# EasyEDA schematic SCH_Final_Drone_2024-05-21.json
TITLE: ATMEGA Based Quadcopter Circuit Design; REV: 1.0; Date: 2020-01-29; Sheet: 1/1; Drawn By: itcef; Company: Tamazgha
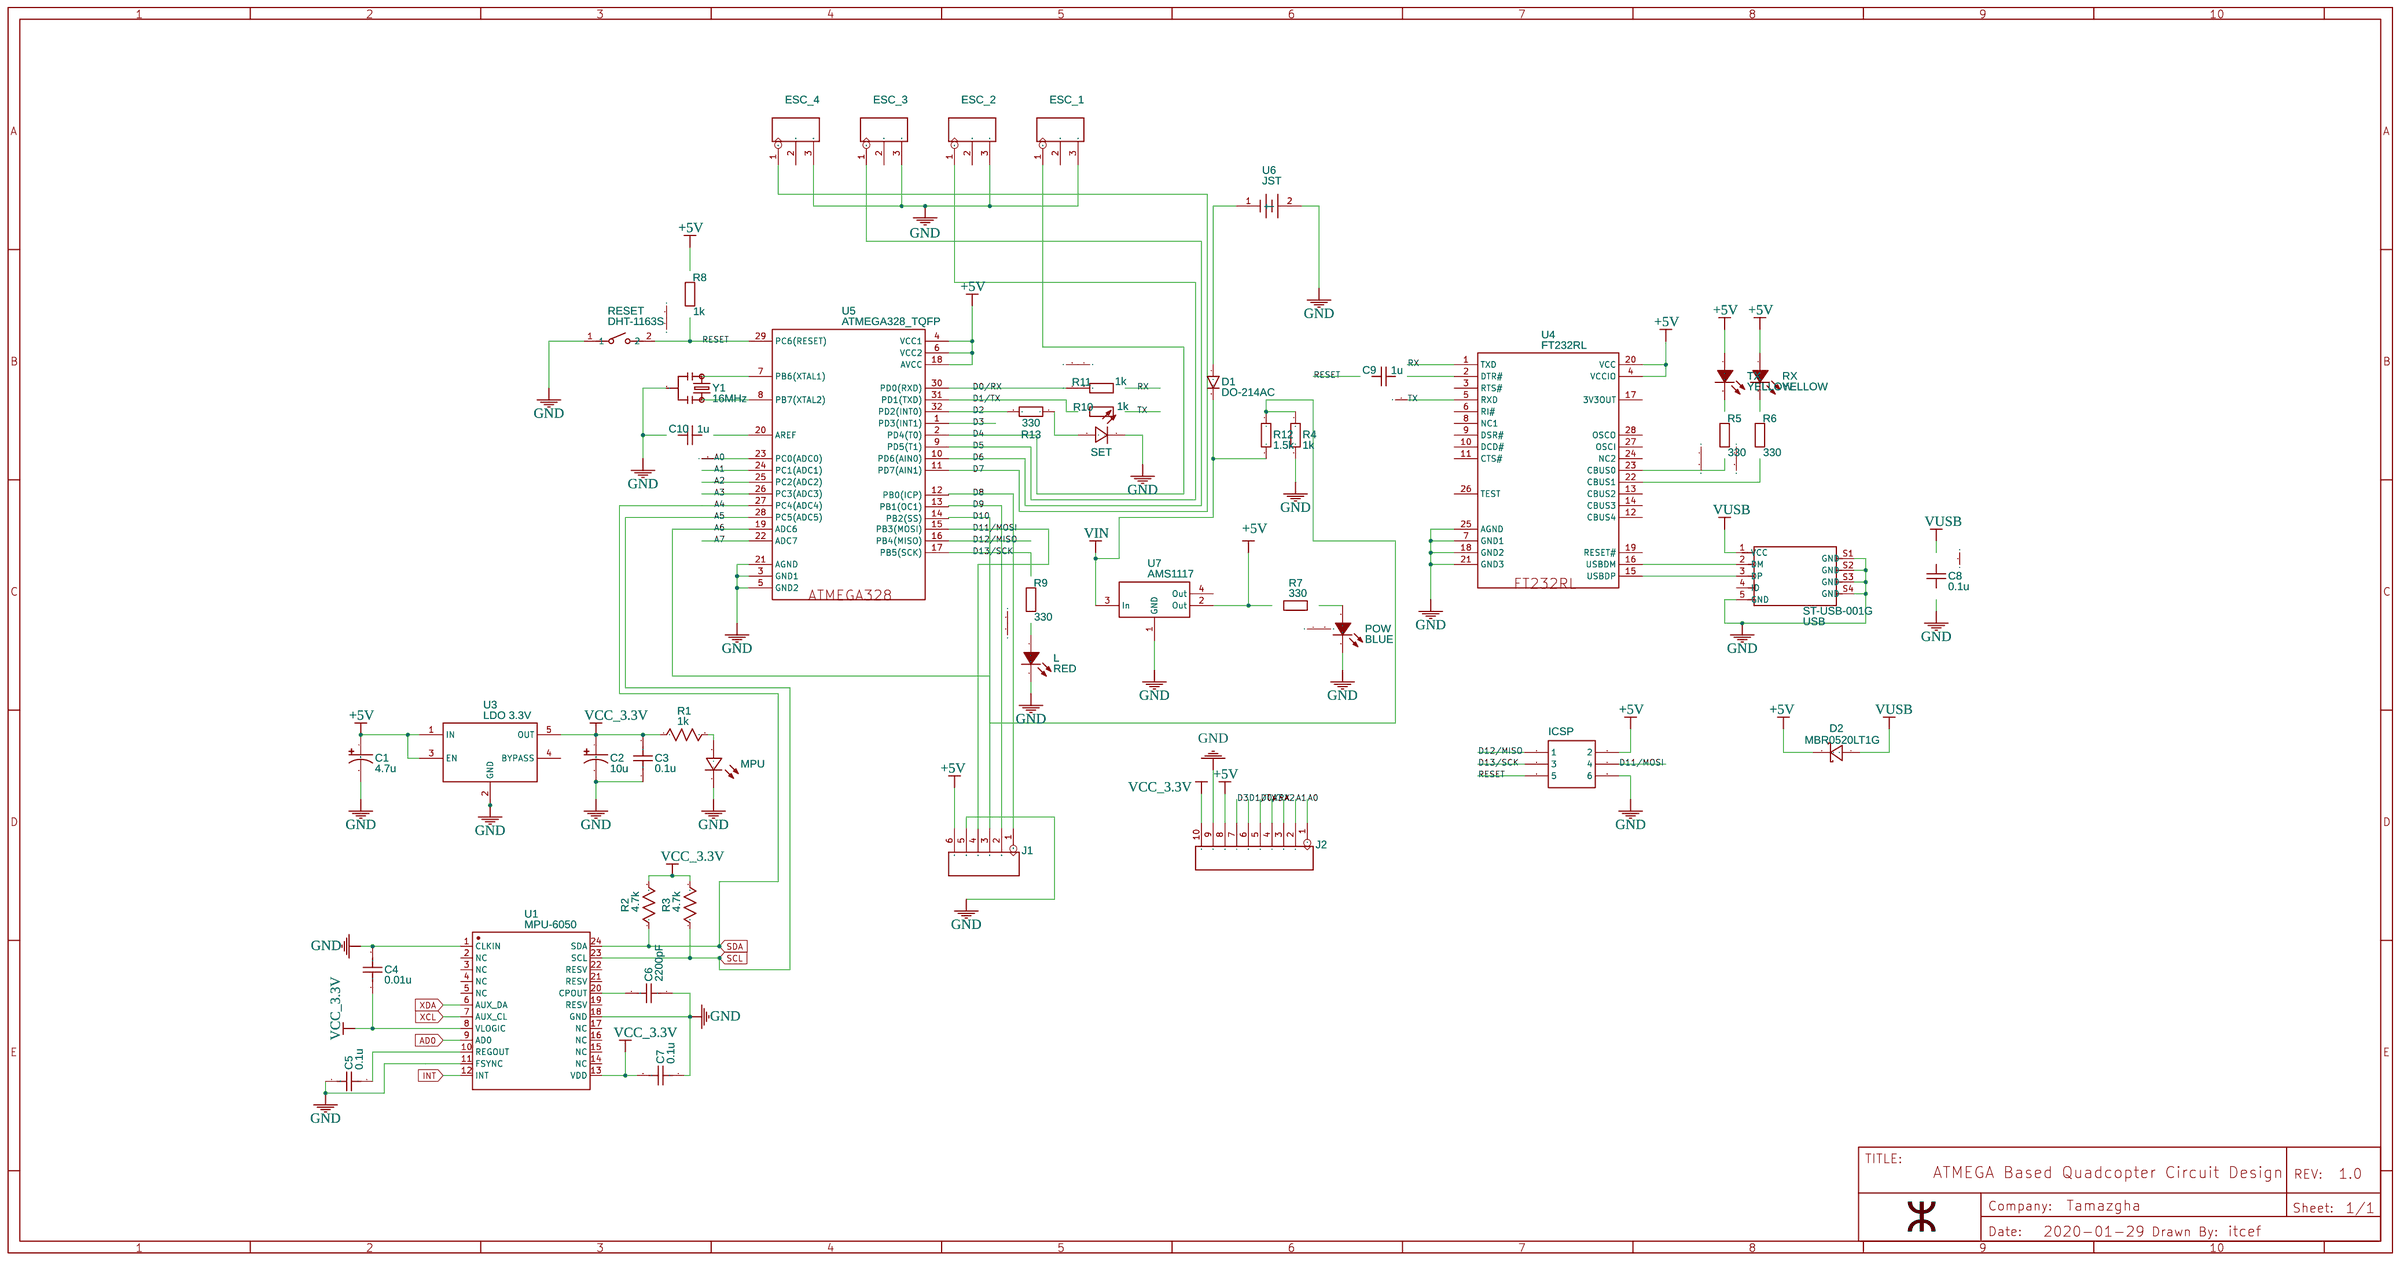
[diagram p0: schematic sheet]

## Parts
C1  4.7u  [C3216]
C2  10u  [C3216]
C3  0.1u  [C0603]
C4  0.01u  [C0603]
C5  0.1u  [C0603]
C6  2200pF  [C0603]
C7  0.1u  [C0603]
C8  0.1u  [C0603]
C9  1u  [C0603]
C10  1u  [C0603]
D1  DO-214AC  [SMA(DO-214AC)]
D2  MBR0520LT1G  [MBR0520LT1G]
ESC_1  DIP-Black-Male-Header-VERT-3P  [H3-2.54]
ESC_2  DIP-Black-Male-Header-VERT-3P  [H3-2.54]
ESC_3  DIP-Black-Male-Header-VERT-3P  [H3-2.54]
ESC_4  DIP-Black-Male-Header-VERT-3P  [H3-2.54]
ICSP  HDR2X3  [HDR2X3]
J1  DIP Long Blue Female Header  [H6-2.54]
J2  DIP-YELLOW-FEMALE-HEADER-VERT(10P-2.54)  [H10-2.54]
L  RED  [D0603-RD]
MPU  LED  [D0603-RD]
POW  BLUE  [D0603-RD]
R1  1k  [R0603]
R2  4.7k  [R0603]
R3  4.7k  [R0603]
R4  1k  [R0603]
R5  330  [R0603]
R6  330  [R0603]
R7  330  [R0603]
R8  1k  [R0603]
R9  330  [R0603]
R10  1k  [R0603]
R11  1k  [R0603]
R12  1.5k  [R0603]
R13  330  [R0603]
RESET  DHT-1163S  [SW2-4.0-6.0X3.0X2.5MM]
RX  YELLOW  [D0603-RD]
SET  LED  [LED-3MM/2.54]
TX  YELLOW  [D0603-RD]
U1  MPU-6050  [QFN-24_4X4X05P]
U3  LDO 3.3V  [SOT-23-5]
U4  FT232RL  [SSOP-28]
U5  ATMEGA328_TQFP  [TQFP32]
U6  JST  [2PIN_2.54_MM_JST_XHP_JST_CONNECTOR]
U7  AMS1117  [SOT-223]
USB  ST-USB-001G  [MICRO-USB5+4P-SMD-0.65-B]
Y1  16MHz  [QUARTZ_SMD_16MHZ]

## Library data of the parts
C1 C2 = Capacitor: Manufacturer Part: ?; Mounted: Yes
C3-C6 = Cap_RAD-0.1_US: Manufacturer Part: ?; Mounted: Yes
C7 = Cap_RAD-0.1_US: Manufacturer Part: ?
C8-C10 = Capacitor: Manufacturer Part: ?
D1 = RS1BB-13-F
D2 = MBR0520LT1G: Contributor: pb158
ESC_1-ESC_4 = DIP-Black-Male-Header-VERT-3P: Manufacturer Part: ?
ICSP = -: catid: 20; Manufacturer Part: ?
J1 = DIP Long Blue Female Header: Manufacturer Part: ?
J2 = DIP-YELLOW-FEMALE-HEADER-VERT(10P-2.54): 320030059
L POW RX TX = LED: Manufacturer Part: ?
MPU SET = -: Supplier: LCSC; Manufacturer: EVERLIGHT; Manufacturer Part: 204-10UYC/S530-A3; Mounted: Yes
R1 = Res_AXIAL-0.3(1/8W)_US: Manufacturer Part: ?
R2 R3 = Res_AXIAL-0.3(1/8W)_US: Manufacturer Part: ?; Mounted: Yes
R4-R13 = Resistor: Manufacturer Part: ?
RESET = -: SMD Button Top;12V; catid: 20; Supplier: SeeedStudio; sourceId: xl1xPJpjB; Supplier Part: 311020029
U1 = -: sourceId: 1T5FDZYC8; Supplier: LCSC; Manufacturer: InvenSense; LCSC Assembly: Yes; image: //image.lceda.cn/szlcsc/C24112.jpg; Supplier Part: C24112
U3 = -: Supplier: LCSC; Manufacturer: TI; Manufacturer Part: TPS79133DBVR; image: //image.lceda.cn/szlcsc/C9838.jpg; Supplier Part: C9838
U4 = -: Contributor: Luo; sourceId: rLzLkiECY; Manufacturer Part: ?
U5 = -: Contributor: Luo; sourceId: 7nXVhCYkG; Manufacturer Part: ?
U6 = XT60: Manufacturer Part: X; Contributor: SpencerPaire
U7 = AMS1117: sourceId: dwIGgezVh; Supplier Part: C6186; Contributor: dvmichurin
USB = -: SMD Micro USB-B-without POST-W/P;; catid: 20; Supplier: SeeedStudio; sourceId: BNHBhbtL3; Supplier Part: 320010000
Y1 = -: Resonator; catid: 20; Contributor: SparkFun; sourceId: EiDZl5rN8; Manufacturer Part: ?

## Nets
+5V: C1.1 D2.2(K) ICSP.2 J1.6(VCC) J2.8 R7.2 R8.2 RX.1 TX.1 U3.1(IN) U3.3(EN) U4.4(VCCIO) U4.20(VCC) U5.4(VCC1) U5.6(VCC2) U5.18(AVCC) U7.2(Out)
GND: C1.2 C2.2 C3.1 C4.2 C5.2 C6.1 C7.1 C8.2 C10.2 ESC_1.3(P$3) ESC_2.3(P$3) ESC_3.3(P$3) ESC_4.3(P$3) ICSP.6 J1.5(GND) J2.9 L.2 MPU.2(-) POW.2 R4.2 RESET.1 SET.2(-) U1.1(CLKIN) U1.11(FSYNC) U1.18(GND) U3.2(GND) U4.7(GND1) U4.18(GND2) U4.21(GND3) U4.25(AGND) U5.3(GND1) U5.5(GND2) U5.21(AGND) U6.2(-) U7.1(GND) USB.5(GND) USB.S1(GND) USB.S2(GND) USB.S3(GND) USB.S4(GND) Y1.2
VCC_3.3V: C2.1 C3.2 C4.1 C7.2 J2.10 R1.1 R2.2 R3.2 U1.8(VLOGIC) U1.13(VDD) U3.5(OUT)
VIN: D1.2(K) R12.2 U7.3(In)
A0: J2.1 U5.23(PC0(ADC0))
A1: J2.2 U5.24(PC1(ADC1))
A2: J2.3 U5.25(PC2(ADC2))
A3: J2.4 U5.26(PC3(ADC3))
A4: R2.1 U1.24(SDA) U5.27(PC4(ADC4))
A5: R3.1 U1.23(SCL) U5.28(PC5(ADC5))
A6: R4.1 R12.1 U5.19(ADC6)
A7: U5.22(ADC7)
AD0: U1.9(AD0)
D0/RX: J2.5 R11.1 U5.30(PD0(RXD))
D1/TX: J2.6 R10.1 U5.31(PD1(TXD))
D2: R13.2 U5.32(PD2(INT0))
D3: J2.7 U5.1(PD3(INT1))
D4: ESC_1.1(P$1) U5.2(PD4(T0))
D5: ESC_2.1(P$1) U5.9(PD5(T1))
D6: ESC_3.1(P$1) U5.10(PD6(AIN0))
D7: ESC_4.1(P$1) U5.11(PD7(AIN1))
D8: J1.1(CH1) U5.12(PB0(ICP))
D9: J1.2(CH2) U5.13(PB1(OC1))
D10: J1.3(CH3) U5.14(PB2(SS))
D11/MOSI: ICSP.4 J1.4(CH4) U5.15(PB3(MOSI))
D12/MISO: ICSP.1 U5.16(PB4(MISO))
D13/SCK: ICSP.3 R9.2 U5.17(PB5(SCK))
INT: U1.12(INT)
RESET: C9.2 ICSP.5 R8.1 RESET.2 U5.29(PC6(RESET))
RX: R11.2 U4.1(TXD)
TX: R10.2 U4.5(RXD)
VUSB: C8.1 D2.1(A) USB.1(VCC)
XCL: U1.7(AUX_CL)
XDA: U1.6(AUX_DA)
Net-(C5-1): C5.1 U1.10(REGOUT)
Net-(C6-2): C6.2 U1.20(CPOUT)
Net-(C9-1): C9.1 U4.2(DTR#)
Net-(C10-1): C10.1 U5.20(AREF)
Net-(D1-1): D1.1(A) U6.1(+)
Net-(L-1): L.1 R9.1
Net-(MPU-1): MPU.1(+) R1.2
Net-(POW-1): POW.1 R7.1
Net-(R5-1): R5.1 U4.23(CBUS0)
Net-(R5-2): R5.2 TX.2
Net-(R6-1): R6.1 U4.22(CBUS1)
Net-(R6-2): R6.2 RX.2
Net-(R13-1): R13.1 SET.1(+)
Net-(U4-15): U4.15(USBDP) USB.3(DP)
Net-(U4-16): U4.16(USBDM) USB.2(DM)
Net-(U5-7): U5.7(PB6(XTAL1)) Y1.1
Net-(U5-8): U5.8(PB7(XTAL2)) Y1.3

Not connected (* = marked no-connect by the designer): ESC_1 2(P$2); ESC_2 2(P$2); ESC_3 2(P$2); ESC_4 2(P$2); U1 2(NC) 3(NC) 4(NC) 5(NC) 14(NC) 15(NC) 16(NC) 17(NC) 19(RESV) 21(RESV) 22(RESV); U3 4(BYPASS); U4 3(RTS#) 6(RI#) 8(NC1) 9(DSR#) 10(DCD#) 11(CTS#) 12(CBUS4) 13(CBUS2) 14(CBUS3) 17(3V3OUT) 19(RESET#) 24(NC2) 26(TEST) 27(OSCI) 28(OSCO); U7 4(Out); USB 4(ID)
